# Altium schematic sheet PSU-IO.SchDoc
size A4
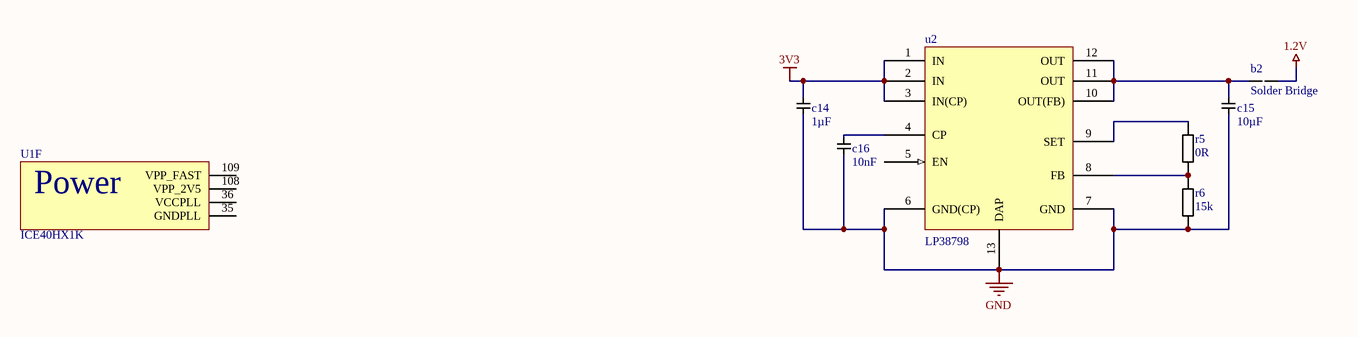
[diagram p0: PSU-IO.SchDoc]

## Parts
b2  Solder Bridge  [Solder Bridge]
c14  1µF  [1206]
c15  10µF  [1206]
c16  10nF  [0603]
r5  0R  [0603]
r6  15k  [0603]
U1  ICE40HX1K  [TQFP-144]  (part F of 6)
u2  LP38798  [WSON-12_4X4]

## Nets
1.2V: b2.2
3V3: c14.2 u2.1(IN) u2.2(IN) u2.3(IN(CP))
GND: c14.1 c15.1 c16.1 r6.1 u2.6(GND(CP)) u2.7(GND) u2.13(DAP)
Netb2_1: b2.1 c15.2 u2.10(OUT(FB)) u2.11(OUT) u2.12(OUT)
Netc16_2: c16.2 u2.4(CP)
Netr5_1: r5.1 r6.2 u2.8(FB)
Netr5_2: r5.2 u2.9(SET)

Not connected (* = marked no-connect by the designer): U1 35(GNDPLL) 36(VCCPLL) 108(VPP_2V5) 109(VPP_FAST); u2 5(EN)

## Notes on the sheet
- (in symbol ICE40HX1K, part F) Power

## Library data of the parts
c14 c15 = 1206 Cap: ...F
c16 = 0603 Capacitor: ...F
r5 r6 = 0603 Resistor: ...R
U1 = ICE40HX1K: ICE40 FPGA TQFP-144
u2 = LP38798: 800mA Ulta-Low-Noise, High-PSRR LDO